# EAGLE schematic Grove-Gas Sensor v1.4 (EAGLE 6.4)
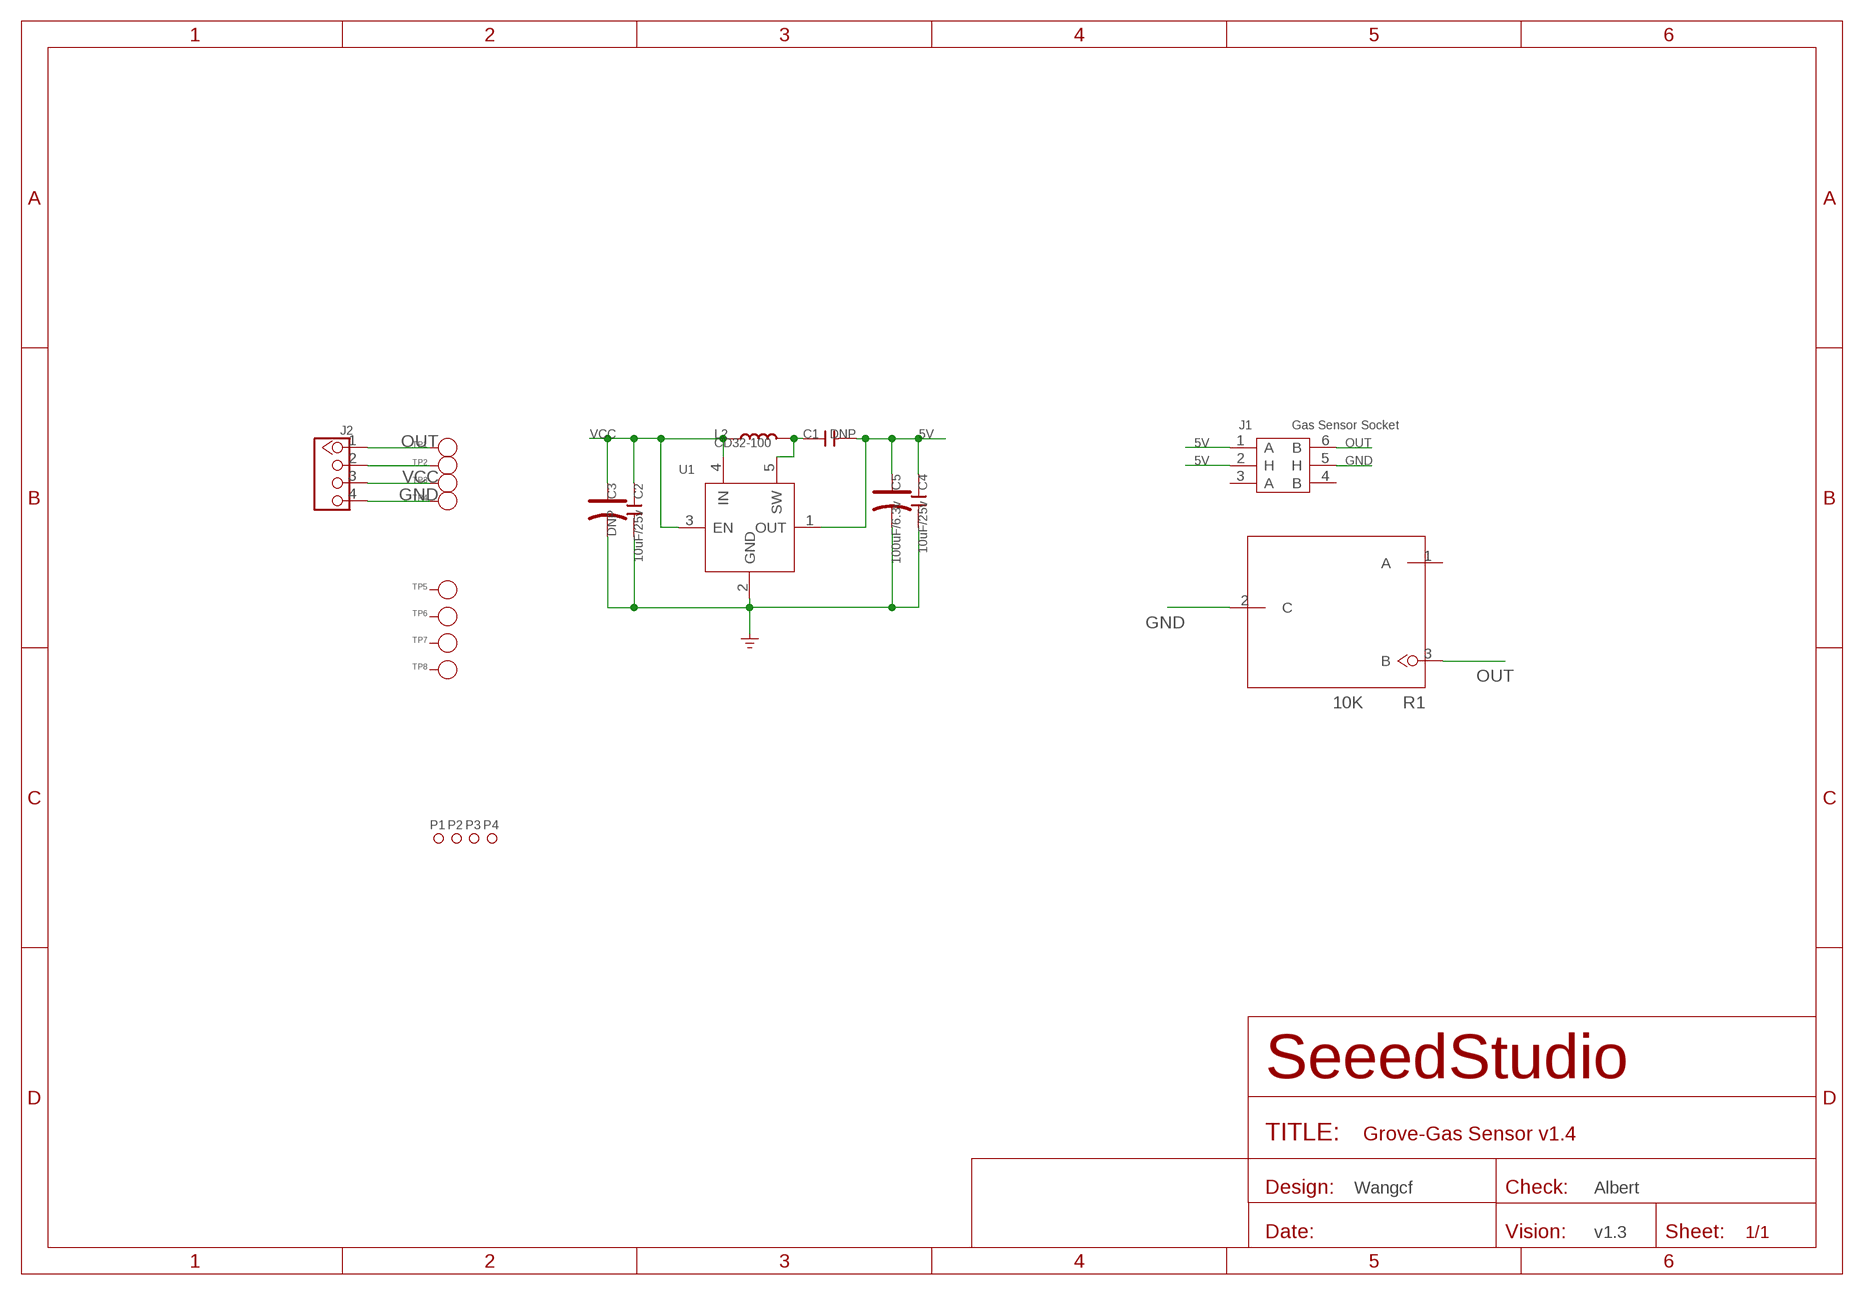
[diagram p0: schematic, sheet 1]

## Parts
C1  DNP  C-0603  [C0603]
C2  10uF/25v  C-0805  [C0805]
C3  DNP  CAP-AVX-A  [AVX-A]
C4  10uF/25v  C-0805  [C0805]
C5  100uF/6.3v  CAP-AVX-B  [AVX-B]
J1  Gas Sensor Socket  MQ-SOCKET  [6P-D17.6X9.8H]
J2  TWIG-2.0-LEADED  [4P-LEADED-2.0]
L2  CD32-100  CD32'4R7'  [SD32-4R7MC]
P1  PAD-MARK'ANNULAR'  [ROUND-MARK-1.0]
P2  PAD-MARK'ANNULAR'  [ROUND-MARK-1.0]
P3  PAD-MARK'ANNULAR'  [ROUND-MARK-1.0]
P4  PAD-MARK'ANNULAR'  [ROUND-MARK-1.0]
R1  10K  DEVICE_RESISTANCE  [PACKAGE__RESISTANCE]
TP1  PAD-TEST-POINT'4545'  [TP_4545]
TP2  PAD-TEST-POINT'4545'  [TP_4545]
TP3  PAD-TEST-POINT'4545'  [TP_4545]
TP4  PAD-TEST-POINT'4545'  [TP_4545]
TP5  PAD-TEST-POINT'4545'  [TP_4545]
TP6  PAD-TEST-POINT'4545'  [TP_4545]
TP7  PAD-TEST-POINT'4545'  [TP_4545]
TP8  PAD-TEST-POINT'4545'  [TP_4545]
U1  ETA1036  [SOT23-5]

## Nets
5V: C1.2 C4.1 C5.+ J1.1(A) J1.2(H) U1.1(OUT)
GND: C2.2 C3.- C4.2 C5.- J1.5(H) J2.4 R1.2(C) TP4.T U1.2(GND)
N$2: C1.1 L2.2 U1.5(SW)
N$4: J2.2 TP2.T
OUT: J1.6(B) J2.1 R1.3(B) TP1.T
VCC: C2.1 C3.+ J2.3 L2.1 TP3.T U1.3(EN) U1.4(IN)
Unconnected: J1.3(A) J1.4(B) R1.1(A) TP5.T TP6.T TP7.T TP8.T

## Notes on the sheet
- Wangcf | Albert
- v1.3

## Library data of the parts
C1 C2 C4 = Discrete:C*: Ceramic Capacitors
C3 C5 = Discrete:CAP*: Electrolytic Capacitors,Tantalum Capacitors and Super Capacitors
J1 = template:MQ-SOCKET
J2 = Connector:TWIG-2.0-LEADED
L2 = template:CD32: ferrite cored coil
P1-P4 = Discrete-new:PAD-MARK; PARTNO: DNP
R1 = test:DEVICE_RESISTANCE
TP1-TP8 = Discrete:PAD-TEST-POINT; PARTNO: DNP
U1 = IC:ETA1036